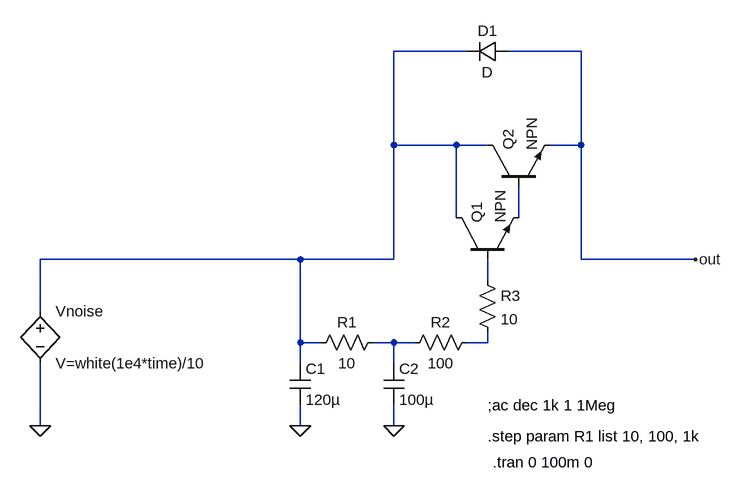
[diagram p0: schematic filter.asc]
filter.asc, the LTspice schematic file:
Version 4
SHEET 1 944 680
WIRE 416 -128 304 -128
WIRE 592 -128 480 -128
WIRE 304 16 304 -128
WIRE 400 16 304 16
WIRE 448 16 400 16
WIRE 592 16 592 -128
WIRE 592 16 544 16
WIRE 400 128 400 16
WIRE 496 128 496 80
WIRE 160 192 -240 192
WIRE 304 192 304 16
WIRE 304 192 160 192
WIRE 592 192 592 16
WIRE 768 192 592 192
WIRE 448 224 448 192
WIRE -240 272 -240 192
WIRE 160 320 160 192
WIRE 192 320 160 320
WIRE 304 320 272 320
WIRE 336 320 304 320
WIRE 448 320 448 304
WIRE 448 320 416 320
WIRE 160 352 160 320
WIRE 304 352 304 320
WIRE -240 448 -240 352
WIRE 160 448 160 416
WIRE 304 448 304 416
FLAG 768 192 out
FLAG -240 448 0
FLAG 304 448 0
FLAG 160 448 0
SYMBOL /cap 288 352 R0
SYMATTR InstName C2
SYMATTR Value 100µ
SYMBOL /diode 480 -144 R90
WINDOW 0 0 32 VBottom 2
WINDOW 3 32 32 VTop 2
SYMATTR InstName D1
SYMBOL /npn 400 192 R270
SYMATTR InstName Q1
SYMBOL /bv -240 256 R0
SYMATTR InstName Vnoise
SYMATTR Value V=white(1e4*time)/10
SYMBOL /res 432 208 R0
SYMATTR InstName R3
SYMATTR Value 10
SYMBOL /npn 448 80 R270
SYMATTR InstName Q2
SYMBOL /res 432 304 R90
WINDOW 0 0 56 VBottom 2
WINDOW 3 32 56 VTop 2
SYMATTR InstName R2
SYMATTR Value 100
SYMBOL /res 288 304 R90
WINDOW 0 0 56 VBottom 2
WINDOW 3 32 56 VTop 2
SYMATTR InstName R1
SYMATTR Value 10
SYMBOL /cap 144 352 R0
SYMATTR InstName C1
SYMATTR Value 120µ
TEXT 448 416 Left 2 !;ac dec 1k 1 1Meg
TEXT 448 464 Left 2 !.step param R1 list 10, 100, 1k
TEXT 456 504 Left 2 !.tran 0 100m 0

The netlist it stands for:
* filter.asc
C2 N004 0 100µ
D1 out N001 D
Q1 N001 N003 N002 0 NPN
B§Vnoise N001 0 V=white(1e4*time)/10
R3 N003 N005 10
Q2 N001 N002 out 0 NPN
R2 N005 N004 100
R1 N004 N001 10
C1 N001 0 120µ
.model D D
.lib standard.dio
.model NPN NPN
.model PNP PNP
.lib standard.bjt
;ac dec 1k 1 1Meg
.step param R1 list 10, 100, 1k
.tran 0 100m 0
.backanno
.end